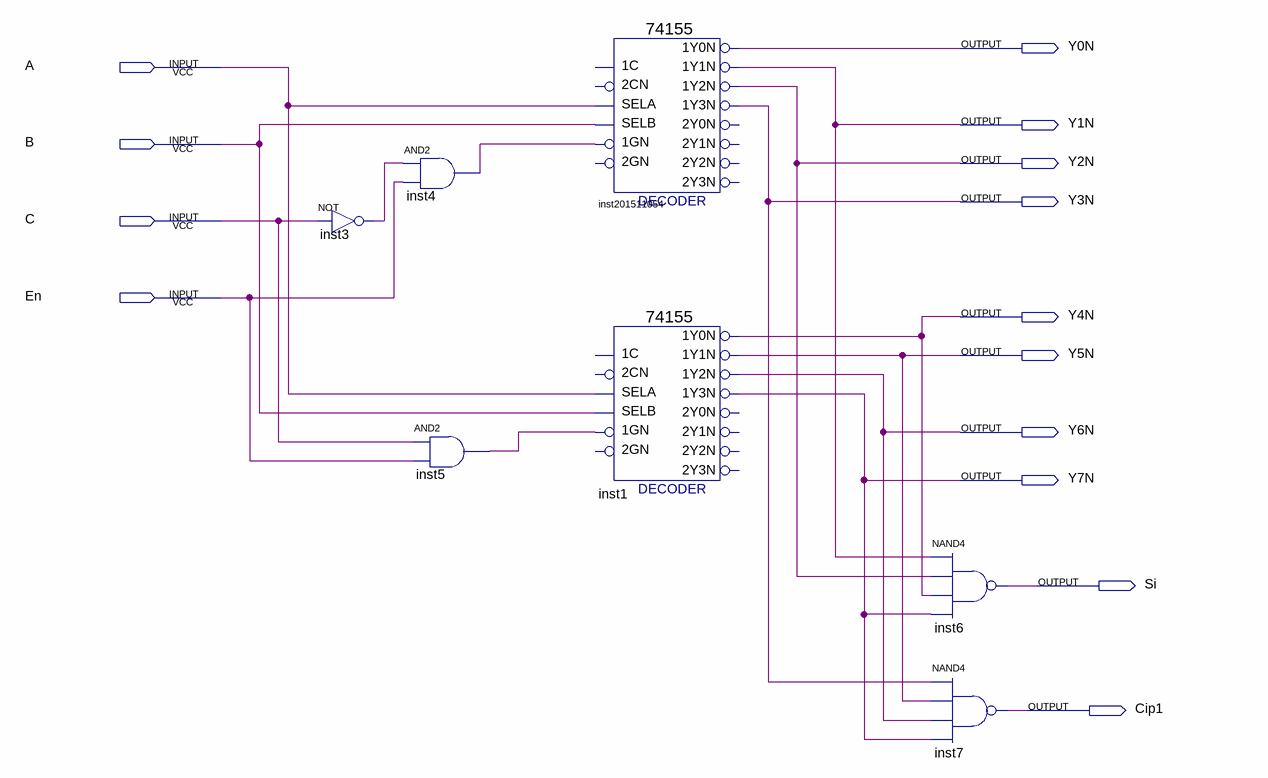
[diagram p0: schematic sheet]
// Quartus schematic lab04_1_2.bdf as structural Verilog: 7 symbols, 14 pins
module lab04_1_2 (
  input  A,
  input  B,
  input  C,
  input  En,
  output Y0N,
  output Y1N,
  output Y2N,
  output Y3N,
  output Y4N,
  output Y5N,
  output Y6N,
  output Y7N,
  output Si,
  output Cip1
);

  wire inst3_out, inst4_out, inst5_out;

  not inst3 (inst3_out, C);
  and inst4 (inst4_out, inst3_out, En);
  and inst5 (inst5_out, C, En);
  \74155  inst201511054 (
    .SELB(B), .SELA(A), .\1GN (inst4_out), .\1Y2N (Y2N), .\1Y1N (Y1N), .\1Y0N (Y0N), .\1Y3N (Y3N));  // open: 1C, 2CN, 2GN, 2Y1N, 2Y0N, 2Y3N, 2Y2N
  \74155  inst1 (
    .SELB(B), .SELA(A), .\1GN (inst5_out), .\1Y2N (Y6N), .\1Y1N (Y5N), .\1Y0N (Y4N), .\1Y3N (Y7N));  // open: 1C, 2CN, 2GN, 2Y1N, 2Y0N, 2Y3N, 2Y2N
  nand inst6 (Si, Y1N, Y2N, Y4N, Y7N);
  nand inst7 (Cip1, Y3N, Y5N, Y6N, Y7N);
endmodule
